# Altium schematic sheet WeatherStation.SchDoc
size C
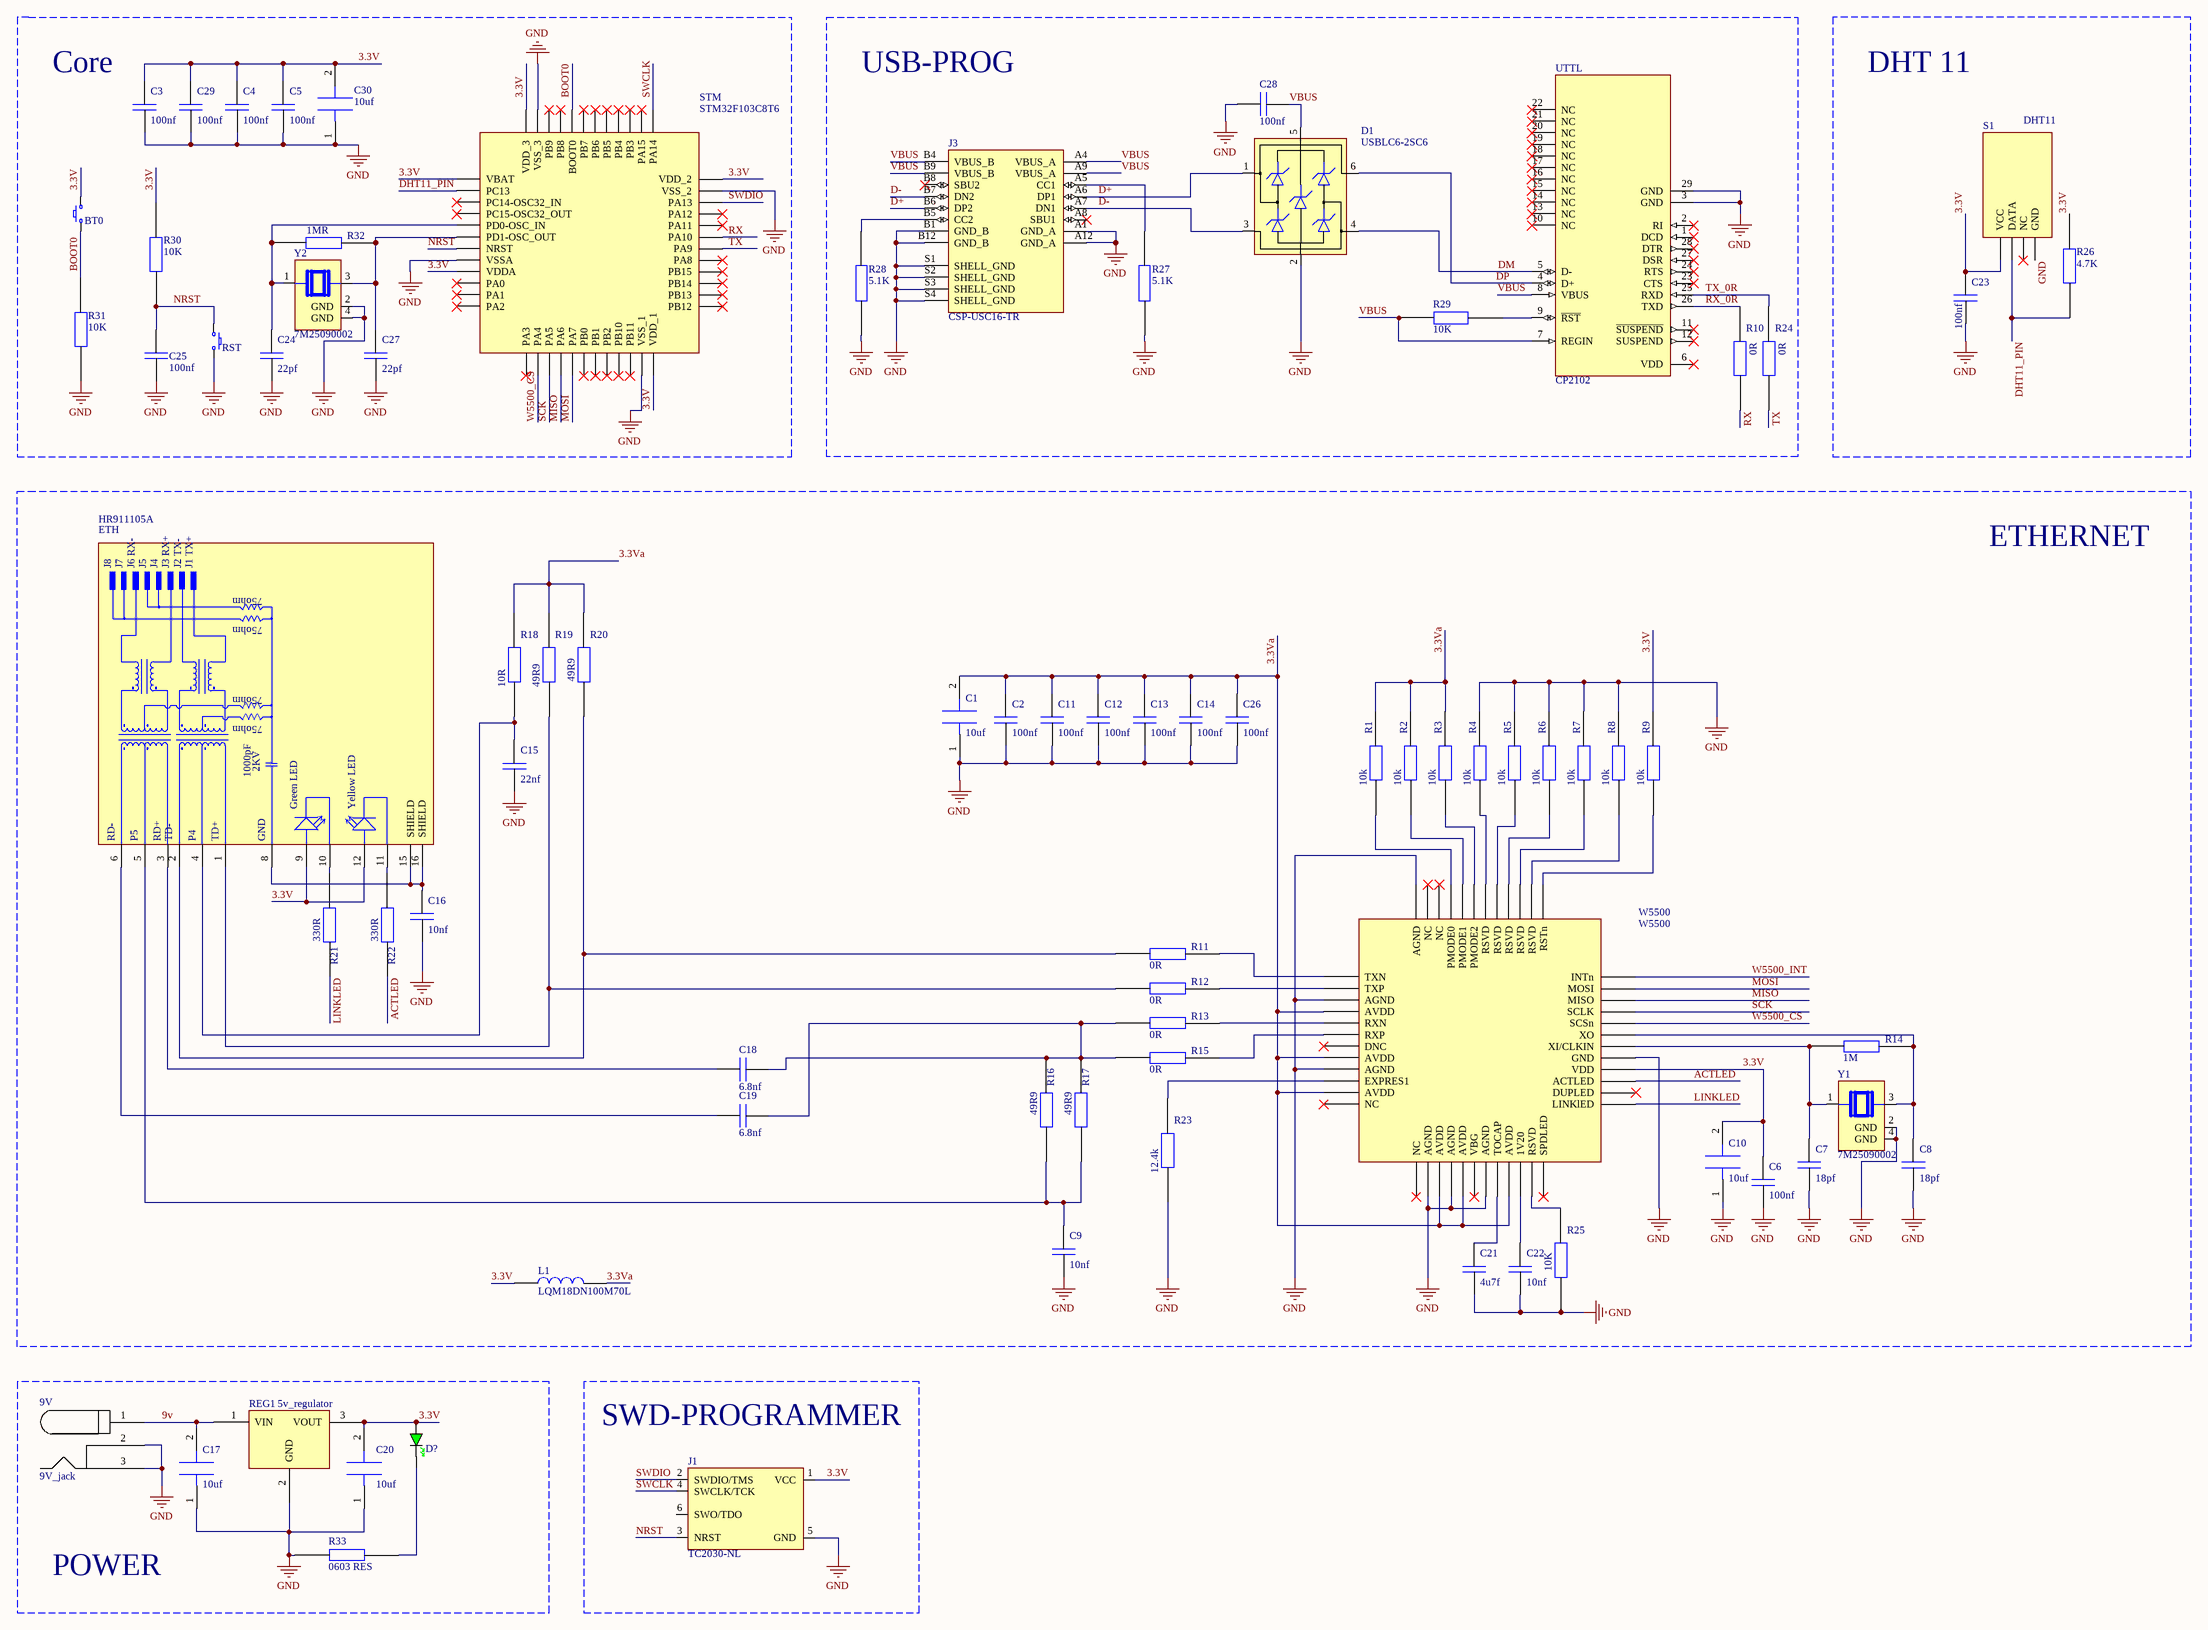
[diagram p0: WeatherStation.SchDoc]

## Parts
9V  9V_jack  [9V_JACK]
BT0  Button_SMD_1  [Button_SMD_1]  (value not drawn)
C1  10uf  [0805_CAP]
C2  100nf  [0603 CAP]
C3  100nf  [0603 CAP]
C4  100nf  [0603 CAP]
C5  100nf  [0603 CAP]
C6  100nf  [0603 CAP]
C7  18pf  [0603 CAP]
C8  18pf  [0603 CAP]
C9  10nf  [0603 CAP]
C10  10uf  [0805_CAP]
C11  100nf  [0603 CAP]
C12  100nf  [0603 CAP]
C13  100nf  [0603 CAP]
C14  100nf  [0603 CAP]
C15  22nf  [0603 CAP]
C16  10nf  [0603 CAP]
C17  10uf  [0805_CAP]
C18  6.8nf  [0603 CAP]
C19  6.8nf  [0603 CAP]
C20  10uf  [0805_CAP]
C21  4u7f  [0603 CAP]
C22  10nf  [0603 CAP]
C23  100nf  [0603 CAP]
C24  22pf  [0603 CAP]
C25  100nf  [0603 CAP]
C26  100nf  [0603 CAP]
C27  22pf  [0603 CAP]
C28  100nf  [0603 CAP]
C29  100nf  [0603 CAP]
C30  10uf  [0805_CAP]
D1  USBLC6-2SC6  [SOT-23-6]
D?  GREEN  [LED_0603_GREEN]  (value not drawn)
ETH  HR911105A  [HANRUN_HR911105A]
J1  TC2030-NL  [TC2030-NL-FP]  (no BOM)
J3  CSP-USC16-TR  [VALCON_CSP-USC16-TR]
L1  LQM18DN100M70L  [INDC1608X95N]
R1  10k  [0603 RES]
R2  10k  [0603 RES]
R3  10k  [0603 RES]
R4  10k  [0603 RES]
R5  10k  [0603 RES]
R6  10k  [0603 RES]
R7  10k  [0603 RES]
R8  10k  [0603 RES]
R9  10k  [0603 RES]
R10  0R  [0603 RES]
R11  0R  [0603 RES]
R12  0R  [0603 RES]
R13  0R  [0603 RES]
R14  1M  [0603 RES]
R15  0R  [0603 RES]
R16  49R9  [0603 RES]
R17  49R9  [0603 RES]
R18  10R  [0603 RES]
R19  49R9  [0603 RES]
R20  49R9  [0603 RES]
R21  330R  [0603 RES]
R22  330R  [0603 RES]
R23  12.4k  [0603 RES]
R24  0R  [0603 RES]
R25  10K  [0603 RES]
R26  4.7K  [0603 RES]
R27  5.1K  [0603 RES]
R28  5.1K  [0603 RES]
R29  10K  [0603 RES]
R30  10K  [0603 RES]
R31  10K  [0603 RES]
R32  1MR  [0603 RES]
R33  0603 RES  [0603 RES]
REG1  5v_regulator  [sot_225]
RST  Button_SMD_1  [Button_SMD_1]  (value not drawn)
S1  DHT11  [DHT11]
STM  STM32F103C8T6  [STM32F103C8T6]
UTTL  CP2102  [QFN50P500X500X100-29N]
W5500  W5500  [W5500]
Y1  7M25090002  [XTAL_7M25090002]
Y2  7M25090002  [XTAL_7M25090002]

## Blocks framed on the sheet
Core: BT0 C3-C5 C24 C25 C27 C29 C30 R30-R32 RST STM Y2
USB-PROG: C28 D1 J3 R10 R24 R27-R29 UTTL
DHT 11: C23 R26 S1
ETHERNET: C1 C2 C6-C16 C18 C19 C21 C22 C26 ETH L1 R1-R9 R11-R23 R25 W5500 Y1
POWER: 9V C17 C20 D? R33 REG1
SWD-PROGRAMMER: J1

## Nets
GND: 9V.2 9V.3 C1.1 C2.1 C3.1 C4.1 C5.1 C6.1 C7.1 C8.1 C9.1 C10.1 C11.1 C12.1 C13.1 C14.1 C15.1 C16.1 C17.1 C20.1 C21.1 C22.1 C23.1 C24.1 C25.1 C26.1 C27.1 C28.1 C29.1 C30.1 D1.2(GND) J1.5(GND) J3.A1(GND_A) J3.A12(GND_A) J3.B1(GND_B) J3.B12(GND_B) J3.S1(SHELL_GND) J3.S2(SHELL_GND) J3.S3(SHELL_GND) J3.S4(SHELL_GND) R4.2 R5.2 R6.2 R7.2 R8.2 R23.1 R25.1 R27.2 R28.1 R31.1 R33.2 REG1.2(GND) RST.2 S1.4(GND) STM.8(VSSA) STM.23(VSS_1) STM.35(VSS_2) STM.47(VSS_3) UTTL.3(GND) UTTL.29(GND) W5500.3(AGND) W5500.9(AGND) W5500.14(AGND) W5500.16(AGND) W5500.19(AGND) W5500.29(GND) W5500.48(AGND) Y1.2(GND) Y1.4(GND) Y2.2(GND) Y2.4(GND)
3.3V: BT0.2 C3.2 C4.2 C5.2 C6.2 C10.2 C20.2 C23.2 C29.2 C30.2 D?.A ETH.9(GA) ETH.12(YA) J1.1(VCC) L1.1 R9.2 R26.2 R30.2 REG1.3(VOUT) S1.1(VCC) STM.1(VBAT) STM.9(VDDA) STM.24(VDD_1) STM.36(VDD_2) STM.48(VDD_3) W5500.28(VDD)
3.3Va: C1.2 C2.2 C11.2 C12.2 C13.2 C14.2 C26.2 L1.2 R1.2 R2.2 R3.2 R18.2 R19.2 R20.2 W5500.4(AVDD) W5500.15(AVDD) W5500.8(AVDD) W5500.11(AVDD) W5500.17(AVDD) W5500.21(AVDD)
9v: 9V.1 C17.2 REG1.1(VIN)
ACTLED: R22.1 W5500.27(ACTLED)
BOOT0: BT0.1 R31.2 STM.44(BOOT0)
D+: D1.1(IO1) J3.A6(DP1) J3.B6(DP2)
D-: D1.3(IO2) J3.A7(DN1) J3.B7(DN2)
DHT11_PIN: R26.1 S1.2(DATA) STM.2(PC13)
DM: D1.4(IO2) UTTL.5(D-)
DP: D1.6(IO1) UTTL.4(D+)
LINKLED: R21.1 W5500.25(LINKlED)
MISO: STM.16(PA6) W5500.34(MISO)
MOSI: STM.17(PA7) W5500.35(MOSI)
NRST: C25.2 J1.3(NRST) R30.1 RST.1 STM.7(NRST)
RX: R10.1 STM.31(PA10)
RX_0R: R10.2 UTTL.26(TXD)
SCK: STM.15(PA5) W5500.33(SCLK)
SWCLK: J1.4(SWCLK/TCK) STM.37(PA14)
SWDIO: J1.2(SWDIO/TMS) STM.34(PA13)
TX: R24.1 STM.30(PA9)
TX_0R: R24.2 UTTL.25(RXD)
VBUS: C28.2 D1.5(VBUS) J3.A4(VBUS_A) J3.A9(VBUS_A) J3.B4(VBUS_B) J3.B9(VBUS_B) R29.1 UTTL.7(REGIN) UTTL.8(VBUS)
W5500_CS: STM.14(PA4) W5500.32(SCSn)
W5500_INT: W5500.36(INTn)
NetC7_2: C7.2 R14.1 W5500.30(XI/CLKIN) Y1.1
NetC8_2: C8.2 R14.2 W5500.31(XO) Y1.3
NetC9_2: C9.2 ETH.5(P5) R16.1 R17.1
NetC15_2: C15.2 ETH.4(P4) R18.1
NetC16_2: C16.2 ETH.8(GND) ETH.15(SHIELD) ETH.16(SHIELD)
NetC18_1: C18.1 ETH.3(RD+)
NetC18_2: C18.2 C19.2 R13.1 R15.1 R16.2 R17.2
NetC19_1: C19.1 ETH.6(RD-)
NetC21_2: C21.2 W5500.20(TOCAP)
NetC22_2: C22.2 W5500.22(1V20)
NetC24_2: C24.2 R32.1 STM.5(PD0-OSC_IN) Y2.1
NetC27_2: C27.2 R32.2 STM.6(PD1-OSC_OUT) Y2.3
NetD?_K: D?.K R33.1
NetETH_1: ETH.1(TD+) R12.1 R19.1
NetETH_2: ETH.2(TD-) R11.1 R20.1
NetETH_10: ETH.10(GC) R21.2
NetETH_11: ETH.11(YC) R22.2
NetJ3_A5: J3.A5(CC1) R27.1
NetJ3_B5: J3.B5(CC2) R28.2
NetR1_1: R1.1 W5500.45(PMODE0)
NetR2_1: R2.1 W5500.44(PMODE1)
NetR3_1: R3.1 W5500.43(PMODE2)
NetR4_1: R4.1 W5500.42(RSVD)
NetR5_1: R5.1 W5500.41(RSVD)
NetR6_1: R6.1 W5500.40(RSVD)
NetR7_1: R7.1 W5500.39(RSVD)
NetR8_1: R8.1 W5500.38(RSVD)
NetR9_1: R9.1 W5500.37(RSTn)
NetR11_2: R11.2 W5500.1(TXN)
NetR12_2: R12.2 W5500.2(TXP)
NetR13_2: R13.2 W5500.5(RXN)
NetR15_2: R15.2 W5500.6(RXP)
NetR23_2: R23.2 W5500.10(EXPRES1)
NetR25_2: R25.2 W5500.23(RSVD)
NetR29_2: R29.2 UTTL.9(~{RST})

Not connected (* = marked no-connect by the designer): J1 6(SWO/TDO); J3 A8(SBU1)* B8(SBU2)*; S1 3(NC)*; STM 3(PC14-OSC32_IN)* 4(PC15-OSC32_OUT)* 10(PA0)* 11(PA1)* 12(PA2)* 13(PA3)* 18(PB0)* 19(PB1)* 20(PB2)* 21(PB10)* 22(PB11)* 25(PB12)* 26(PB13)* 27(PB14)* 28(PB15)* 29(PA8)* 32(PA11)* 33(PA12)* 38(PA15)* 39(PB3)* 40(PB4)* 41(PB5)* 42(PB6)* 43(PB7)* 45(PB8)* 46(PB9)*; UTTL 1(DCD)* 2(RI)* 6(VDD)* 10(NC)* 11(~{SUSPEND})* 12(SUSPEND)* 13(NC)* 14(NC)* 15(NC)* 16(NC)* 17(NC)* 18(NC)* 19(NC)* 20(NC)* 21(NC)* 22(NC)* 23(CTS)* 24(RTS)* 27(DSR)* 28(DTR)*; W5500 12 (NC)* 13(NC)*  7(DNC)*  18(VBG)*  24(SPDLED)*  26(DUPLED)*  46(NC)*  47(NC)*

## Notes on the sheet
- (in symbol HR911105A) J8; J7; J6 RX-; J5; J4; J3 RX+; J2 TX-; J1 TX+; 75ohm; 2KV; 1000pF; Green LED; Yellow LED

## Library data of the parts
C1 C10 C17 C20 C30 = 0805_CAPACITOR
C2-C9 C11-C16 C18 C19 C21-C29 = 0603 CAP
D1 = USBLC6-2SC6: Low-Capacitance ESD Protection USB; Manufacturer: STMicroelectronics; Manufacturer Part Number: USBLC6-2SC6; Distributor Link: https://www.mouser.de/ProductDetail/STMicroelectronics/USBLC6-2SC6?qs=po45yt2pPpu%2FhNIlwQdTlg%3D%3D
D? = LED_0603_GREEN: LED 0603 GREEN SMD
ETH = HR911105A: DIP RJ45 Connector;; MF: hanrun; SnapEDA_Link: https://www.snapeda.com/parts/HR911105A/HanRun/view-part/?ref=snap; Package: None; MP: HR911105A; Check_prices: https://www.snapeda.com/parts/HR911105A/HanRun/view-part/?ref=eda; Price: None; Value: *; Availability: Not in stock
J1 = TC2030-NL: Tag-Connect No-Solder SWD Debug Connector (No Legs) DO NOT PLACE; Manufacturer: Tag-Connect; Manufacturer Part Number: TC2030-NL-FP
J3 = CSP-USC16-TR: CSP-USC16-TR Valcon USB Type C Surface Mount PCB Socket; SnapEDA_Link: https://www.snapeda.com/parts/CSP-USC16-TR/Valcon/view-part/?ref=snap; MF: Valcon; MP: CSP-USC16-TR; Availability: In Stock; Price: None; Value: *; Check_prices: https://www.snapeda.com/parts/CSP-USC16-TR/Valcon/view-part/?ref=eda; Package: None; Purchase-URL: https://pricing.snapeda.com/search/part/CSP-USC16-TR/?ref=eda
L1 = LQM18DN100M70L: Inductor with Inductance 10uH Tol.+/-20% Package 0603 (1608); MF: Murata Electronics; MP: LQM18DN100M70L; Price: None; SnapEDA_Link: https://www.snapeda.com/parts/LQM18DN100M70L/Murata/view-part/4834755/?ref=snap; Package: 0603 Murata; Availability: Unavailable; Value: *
R1-R32 = 0603 RES
UTTL = CP2102: CP2102N USB 2.0 to UART (RS232) Bridge Interface Evaluation Board; MF: Silicon Labs; Purchase-URL: https://pricing.snapeda.com/search/part/CP2102/?ref=eda; Package: WFQFN-20 Silicon Labs; Value: *; Check_prices: https://www.snapeda.com/parts/CP2102/Silicon+Labs/view-part/?ref=eda; SnapEDA_Link: https://www.snapeda.com/parts/CP2102/Silicon+Labs/view-part/?ref=snap; Availability: In Stock; Price: None; MP: CP2102
Y1 = 7M25090002: 25 MHz Â±10ppm Crystal 18pF 4-SMD, No Lead; MF: TXC; Availability: In Stock; Check_prices: https://www.snapeda.com/parts/7M25090002/TXC/view-part/?ref=eda; Price: None; SnapEDA_Link: https://www.snapeda.com/parts/7M25090002/TXC/view-part/?ref=snap; MP: 7M25090002; Value: *; Purchase-URL: https://pricing.snapeda.com/search/part/7M25090002/?ref=eda; Package: SMD-4 TXC
Y2 = 7M25090002: 8 MHz Â±10ppm Crystal 18pF 4-SMD, No Lead; MF: TXC; Availability: In Stock; Check_prices: https://www.snapeda.com/parts/7M25090002/TXC/view-part/?ref=eda; Price: None; SnapEDA_Link: https://www.snapeda.com/parts/7M25090002/TXC/view-part/?ref=snap; MP: 7M25090002; Value: *; Purchase-URL: https://pricing.snapeda.com/search/part/7M25090002/?ref=eda; Package: SMD-4 TXC